# Altium schematic sheet Project_Information.SchDoc: =project_title
size Tabloid; CompanyName: Luxonis Holding; Organization: Luxonis Holding; Address1: 1925 Harmony Park Drive; Address2: Westminster, CO; Address3: 80234; Address4: United States; SheetNumber: 1; SheetTotal: 17
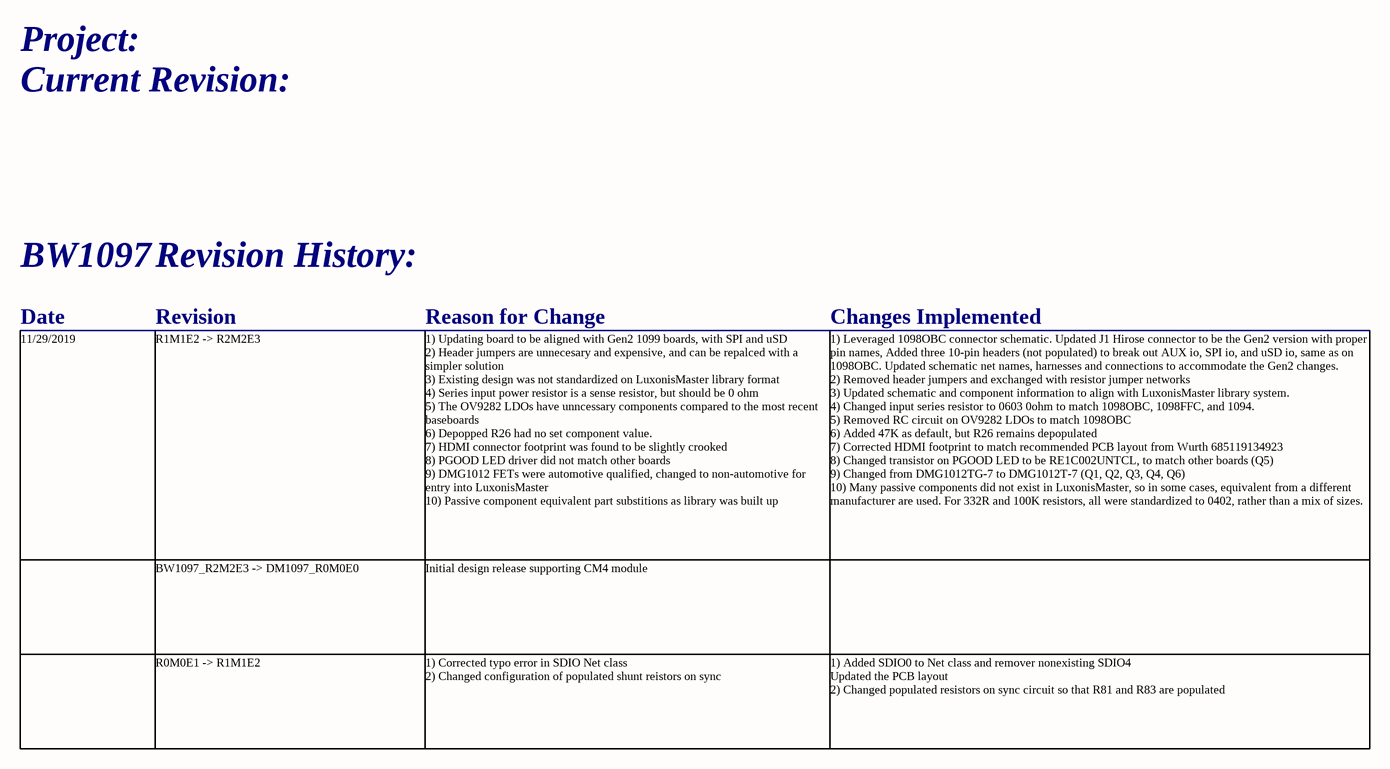
[diagram p0: Project_Information.SchDoc]

## Notes on the sheet
- Project:
- Current Revision:
- BW1097
- Revision History:
- Date
- Revision
- Reason for Change
- Changes Implemented
- 11/29/2019
- R1M1E2 -> R2M2E3
- 1) Updating board to be aligned with Gen2 1099 boards, with SPI and uSD
  2) Header jumpers are unnecesary and expensive, and can be repalced with a simpler solution
  3) Existing design was not standardized on LuxonisMaster library format
  4) Series input power resistor is a sense resistor, but should be 0 ohm
  5) The OV9282 LDOs have unncessary components compared to the most recent baseboards
  6) Depopped R26 had no set component value.
  7) HDMI connector footprint was found to be slightly crooked
  8) PGOOD LED driver did not match other boards
  9) DMG1012 FETs were automotive qualified, changed to non-automotive for entry into LuxonisMaster
  10) Passive component equivalent part substitions as library was built up
- 1) Leveraged 1098OBC connector schematic. Updated J1 Hirose connector to be the Gen2 version with proper pin names, Added three 10-pin headers (not populated) to break out AUX io, SPI io, and uSD io, same as on 1098OBC. Updated schematic net names, harnesses and connections to accommodate the Gen2 changes.
  2) Removed header jumpers and exchanged with resistor jumper networks
  3) Updated schematic and component information to align with LuxonisMaster library system.
  4) Changed input series resistor to 0603 0ohm to match 1098OBC, 1098FFC, and 1094.
  5) Removed RC circuit on OV9282 LDOs to match 1098OBC
  6) Added 47K as default, but R26 remains depopulated
  7) Corrected HDMI footprint to match recommended PCB layout from Wurth 685119134923
  8) Changed transistor on PGOOD LED to be RE1C002UNTCL, to match other boards (Q5)
  9) Changed from DMG1012TG-7 to DMG1012T-7 (Q1, Q2, Q3, Q4, Q6)
  10) Many passive components did not exist in LuxonisMaster, so in some cases, equivalent from a different manufacturer are used. For 332R and 100K resistors, all were standardized to 0402, rather than a mix of sizes.
- BW1097_R2M2E3 -> DM1097_R0M0E0
- Initial design release supporting CM4 module
- R0M0E1 -> R1M1E2
- 1) Corrected typo error in SDIO Net class
  2) Changed configuration of populated shunt reistors on sync
- 1) Added SDIO0 to Net class and remover nonexisting SDIO4
  Updated the PCB layout
  2) Changed populated resistors on sync circuit so that R81 and R83 are populated
- Title
- Size:
- Date:
- Tabloid
- Number:
- Time:
- Revision:
- Sheet
- of
- Drawn by: